# EAGLE design tutuShield (EAGLE 7.1.0)
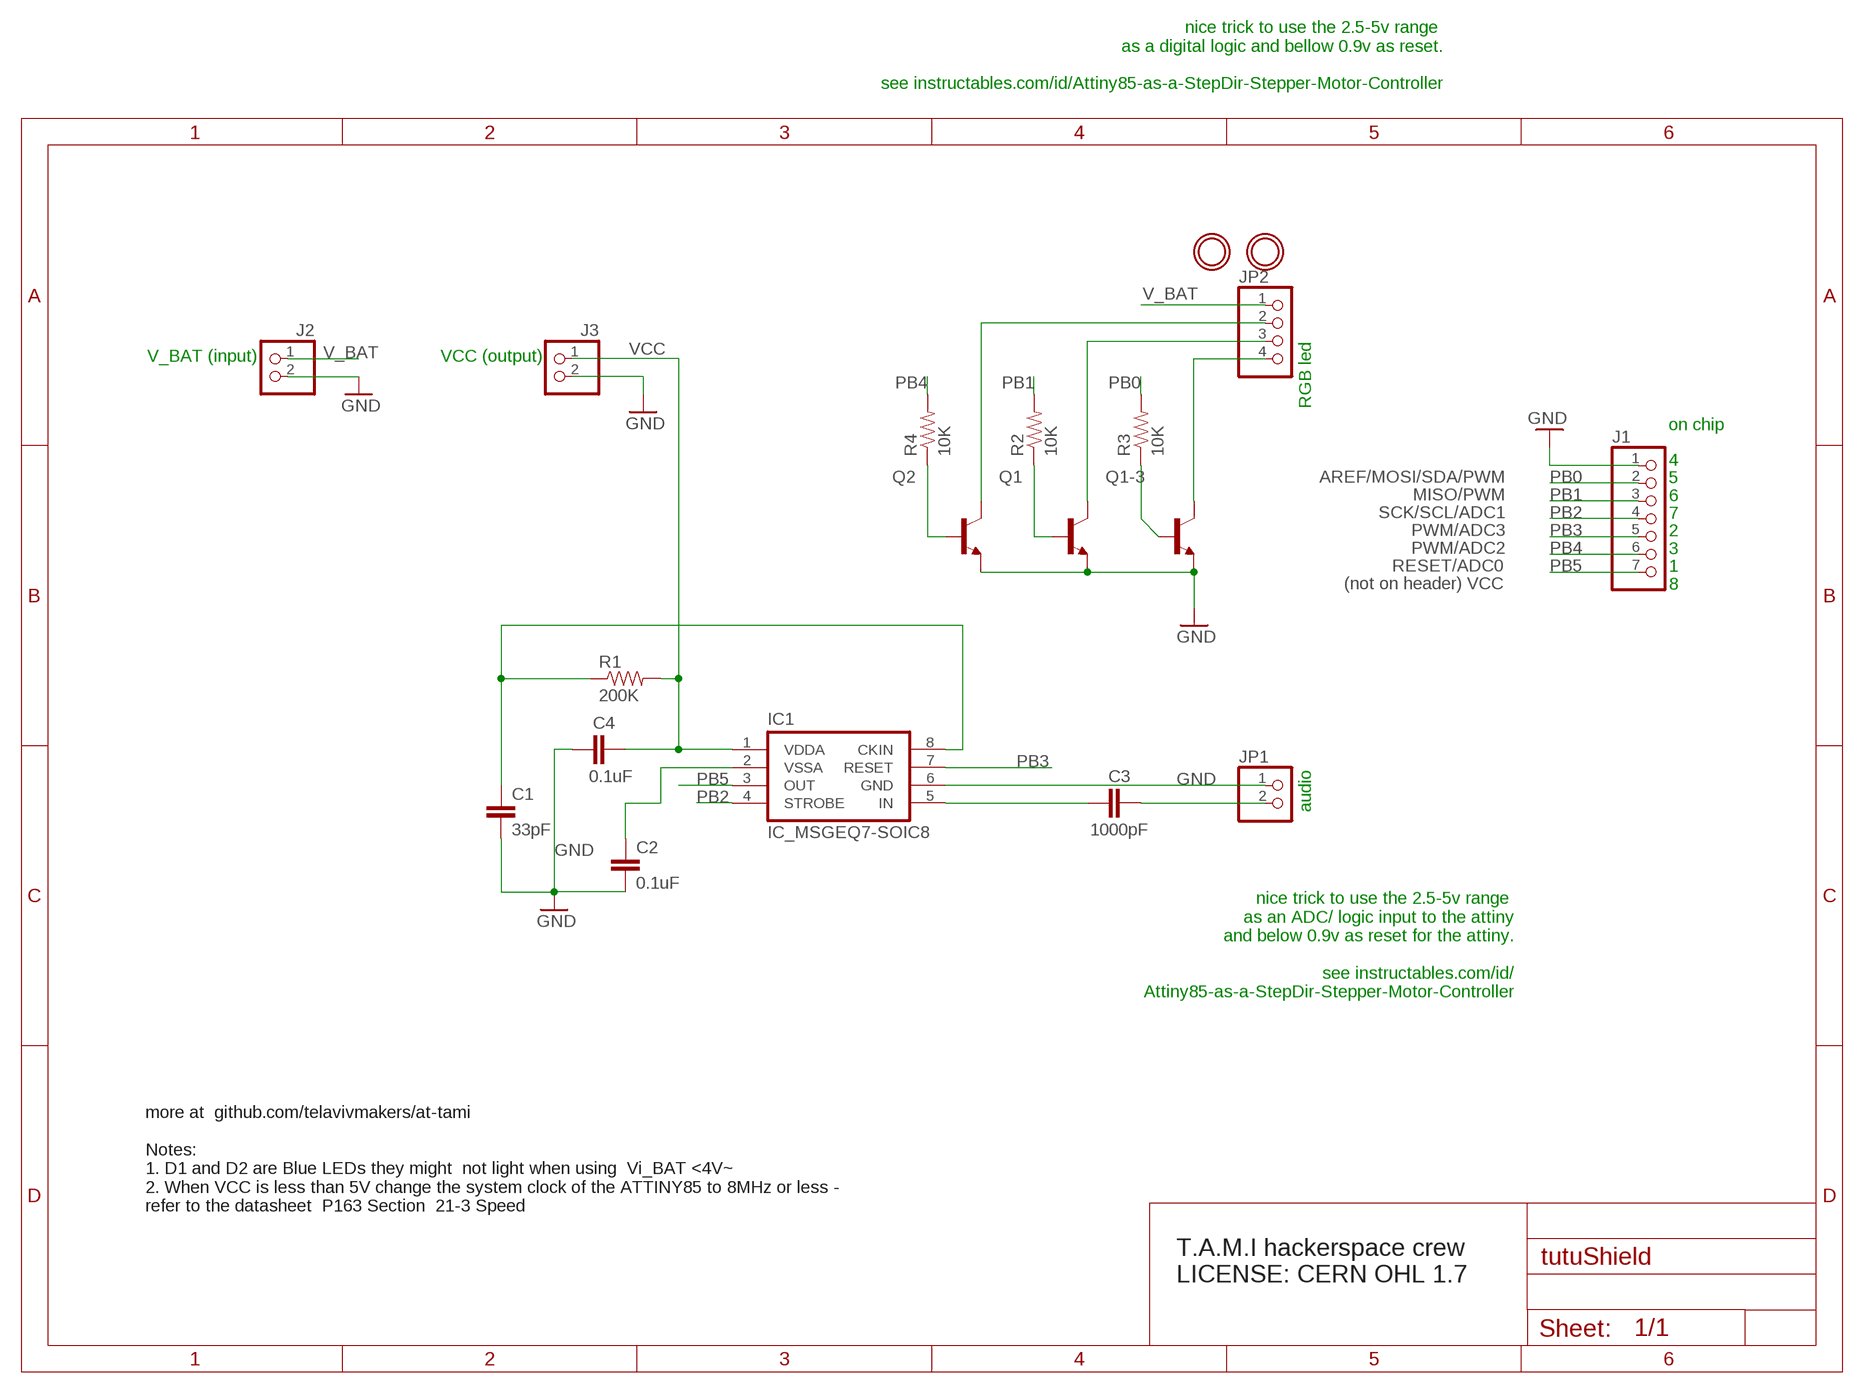
[diagram p0: schematic, sheet 1]

## Parts
C1  33pF  CAP0805  [0805]
C2  0.1uF  CAP0805  [0805]
C3  1000pF  CAP0805  [0805]
C4  0.1uF  CAP0805  [0805]
IC1  IC_MSGEQ7-SOIC8  [SOIC-8]
J1  HEADER-1X7ROUND  [1X07_ROUND]
J2  HEADER-1X2ROUND  [1X02_ROUND]
J3  HEADER-1X2ROUND  [1X02_ROUND]
JP1  HEADER-1X2ROUND  [1X02_ROUND]
JP2  HEADER-1X4ROUND  [1X04_ROUND]
Q1  TRANSISTOR_BJT_NPN-SOT-23-BEC  [SOT-23]
Q1-3  TRANSISTOR_BJT_NPN-SOT-23-BEC  [SOT-23]
Q2  TRANSISTOR_BJT_NPN-SOT-23-BEC  [SOT-23]
R1  200K  RESISTOR0805-RES  [0805]
R2  10K  RESISTOR0805-RES  [0805]
R3  10K  RESISTOR0805-RES  [0805]
R4  10K  RESISTOR0805-RES  [0805]
U$1  MOUNTINGHOLE2.0  [MOUNTINGHOLE_2.0_PLATED]
U$2  MOUNTINGHOLE2.0  [MOUNTINGHOLE_2.0_PLATED]

## Nets
CKIN: C1.1 IC1.8(CKIN) R1.1
GND: C1.2 C2.2 C4.1 IC1.6(GND) J1.1 J2.2 J3.2 JP1.1 Q1-3.2(E) Q1.2(E) Q2.2(E)
IN: C3.1 IC1.5(IN)
N$1: C3.2 JP1.2
N$3: Q1-3.1(B) R3.1
N$4: JP2.2 Q2.3(C)
N$5: C2.1 IC1.2(VSSA)
N$6: Q1.1(B) R2.1
N$7: Q2.1(B) R4.1
N$8: JP2.4 Q1-3.3(C)
N$14: JP2.3 Q1.3(C)
PB0: J1.2 R3.2
PB1: J1.3 R2.2
PB2: IC1.4(STROBE) J1.4
PB3: IC1.7(RESET) J1.5
PB4: J1.6 R4.2
PB5: IC1.3(OUT) J1.7
V_BAT: J2.1 JP2.1
VCC: C4.2 IC1.1(VDDA) J3.1 R1.2

## Notes on the sheet
- nice trick to use the 2.5-5v range 
  as a digital logic and bellow 0.9v as reset.
  
  see instructables.com/id/Attiny85-as-a-StepDir-Stepper-Motor-Controller
- V_BAT (input) | VCC (output)
- RGB led
- AREF/MOSI/SDA/PWM
- MISO/PWM
- SCK/SCL/ADC1
- PWM/ADC3
- PWM/ADC2
- RESET/ADC0
- (not on header) VCC
- on chip
  
  4
  5
  6
  7
  2
  3
  1
  8
- audio
- nice trick to use the 2.5-5v range 
  as an ADC/ logic input to the attiny
  and below 0.9v as reset for the attiny.
  
  see instructables.com/id/
  Attiny85-as-a-StepDir-Stepper-Motor-Controller
- more at  github.com/telavivmakers/at-tami
  
  Notes: 
  1. D1 and D2 are Blue LEDs they might  not light when using  Vi_BAT <4V~  
  2. When VCC is less than 5V change the system clock of the ATTINY85 to 8MHz or less - 
  refer to the datasheet  P163 Section  21-3 Speed
- T.A.M.I hackerspace crew 
  LICENSE: CERN OHL 1.7

## Library data of the parts
C1-C4 = ATtami:CAP: Capacitor Standard 0603 ceramic capacitor, and 0.1" leaded capacitor.
IC1 = ATtami:IC_MSGEQ7: seven band Graphic Equalizer IC
J1 = microbuilder:HEADER-1X7: PIN HEADER
J2 J3 = microbuilder:HEADER-1X2: PIN HEADER
JP1 = ATtami:HEADER-1X2: PIN HEADER
JP2 = ATtami:HEADER-1X4: PIN HEADER
Q1 Q1-3 Q2 = dp_devices:TRANSISTOR_BJT_NPN: Most commonly used is SOT23-BEC
R1-R4 = ATtami:RESISTOR: Resistor Basic schematic elements and footprints for 0603, 1206, and PTH resistors.
U$1 U$2 = microbuilder:MOUNTINGHOLE: Mounting Hole For #2 screws (0.086"/2.18mm width, 0.094"/2.4mm hole) use 2.5mm

## Net classes
0 default: width 0.203 mm
1 vcc: width 0.254 mm

## Board
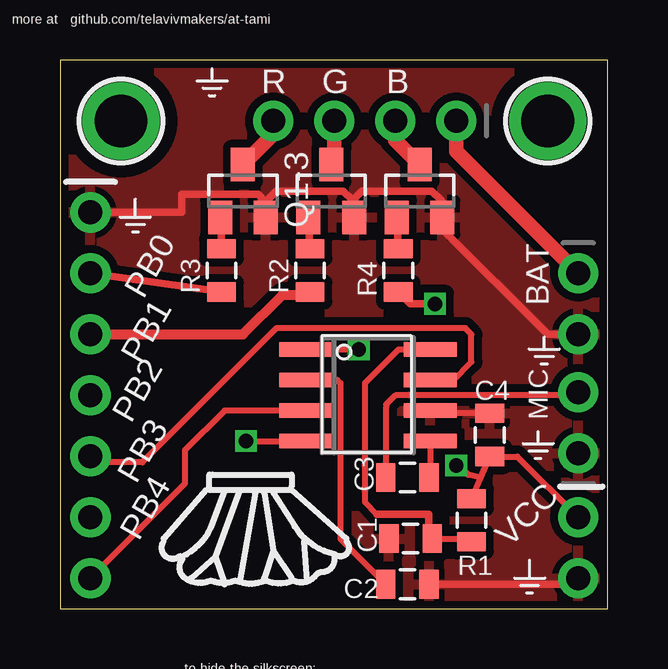
[diagram p1: board, top side]
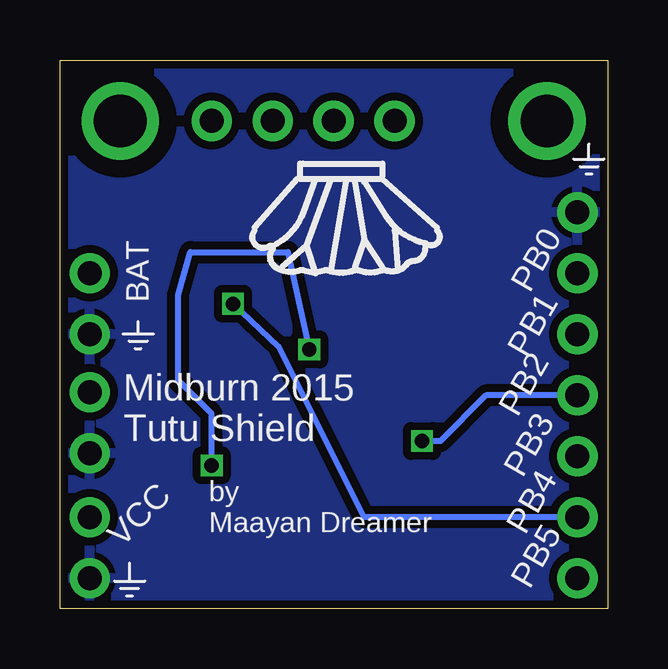
[diagram p2: board, bottom side, seen from below]

Size 22.83 x 22.86 mm. Coordinates in mm from the lower left corner, seen from the top.
Outline: 0,0 22.83,0 22.83,22.86 0,22.86 0,0
Copper layers (1*16): Top 0.035mm / dielectric 1.5mm / Bottom 0.035mm
Design rules "Elecrow_2-layer_eagle_rule": minimum track width 6mil, minimum drill 12mil, track to track 6mil, track to pad 6mil, pad to pad 6mil, via to via 6mil, smd to smd 0mil, copper to edge 10mil, drill to drill 10mil, minimum pad ring 10mil, minimum via ring 6mil, stop-mask expansion 2mil, vias tented up to drill 100mil, thermal gap 10mil

### Footprints (pad centres in the part's own frame; a part is rotated, then mirrored left to right if it is on the bottom)
0805 = smd 0.8 x 1.2: 1 -0.9,0; 2 0.9,0
SOIC-8 = smd 0.6 x 2.2: 1 -1.905,-2.6; 2 -0.635,-2.6; 3 0.635,-2.6; 4 1.905,-2.6; 5 1.905,2.6; 6 0.635,2.6; 7 -0.635,2.6; 8 -1.905,2.6
1X07_ROUND = drill 1 pad 1.676: 1 -7.62,0; 2 -5.08,0; 3 -2.54,0; 4 0,0; 5 2.54,0; 6 5.08,0; 7 7.62,0
1X02_ROUND = drill 1 pad 1.676: 1 -1.27,0; 2 1.27,0
1X04_ROUND = drill 1 pad 1.676: 1 -3.81,0; 2 -1.27,0; 3 1.27,0; 4 3.81,0
SOT-23 = smd 1 x 1.4: 1 -0.95,-1.1; 2 0.95,-1.1; 3 0,1.1
MOUNTINGHOLE_2.0_PLATED = drill 2.2 pad 3: P$1 0,0

### Placement (x,y rotation side)
C1  14.61,2.92 180 top
C2  14.48,1.02 0 top
C3  14.48,5.46 180 top
C4  17.91,7.24 270 top
IC1  12.83,8.89 270 top
J1  1.27,8.89 270 top
J2  21.59,12.7 270 top
J3  21.59,2.54 270 top
JP1  21.59,7.75 90 top
JP2  12.7,20.32 180 top
Q1  11.3,17.4 0 top
Q1-3  7.62,17.4 0 top
Q2  14.99,17.4 0 top
R1  17.14,3.68 90 top
R2  10.41,14.1 270 top
R3  6.73,14.1 270 top
R4  14.1,14.1 270 top
U$1  2.54,20.32 270 top
U$2  20.32,20.32 0 top

### Tracks (layer width: path | path; a pad name or v marks a point on that pad's centre or on a via)
CKIN
  Top 0.254: C1.1 17.14,2.92 R1.1 | IC1.8 14.1,10.79 12.7,9.4 12.7,4.45 13.21,3.94
  Top 0.305: 13.21,3.94 15.37,3.94 15.37,3.05 C1.1
GND
  Top 0.254: C4.1 15.54,8.14 IC1.6
  Top 0.305: C2.2 21.34,1.02 J3.2 | J1.1 5.08,16.51 5.08,17.27 8.26,17.27 8.38,17.14 8.38,16.49 Q1-3.2 8.57,16.95 9.02,17.4 11.81,17.4 12.19,17.02 12.19,16.36 Q1.2 12.25,17.08 12.57,17.4 15.49,17.4 15.88,17.02 15.88,16.36 Q2.2 15.94,15.81 20.32,11.43 J2.2
  pour Bottom (isolate 0.33): 23.37,23.75 -1.52,23.62 -1.21,-1.43 23.37,-1.02
  pour Top (isolate 0.33): -1.02,23.5 -1.02,-0.51 23.62,-0.51 23.3,23.53
IN
  Top 0.254: IC1.5 15.43,5.51 C3.1
N$1
  Top 0.254: JP1.2 21.46,8.89 13.97,8.89 13.59,8.51 13.59,8.38 13.58,8.37 C3.2
N$3
  Top 0.305: Q1-3.1 R3.1
N$4
  Top 0.61: JP2.2 13.97,19.52 Q2.3
N$5
  Top 0.254: IC1.2 11.56,9.53 11.68,9.4 11.68,2.91 C2.1
  Top 0.305: C2.1 13.46,1.02
N$6
  Top 0.305: Q1.1 R2.1
N$7
  Top 0.305: Q2.1 R4.1
N$8
  Top 0.61: JP2.4 8.89,19.77 Q1-3.3
N$14
  Top 0.61: JP2.3 11.43,18.63 Q1.3
PB0
  Top 0.305: R3.2 J1.2
PB1
  Top 0.406: J1.3 7.62,11.43 9.27,13.08 10.3,13.08 R2.2
PB2  (via drill 0.6)
  Top 0.254: v7.75,6.99 IC1.4
  Bottom 0.254: J1.4 5.08,8.89 6.99,6.99 v7.75,6.99
PB3
  Top 0.254: IC1.7 16.38,9.53 17.14,10.29 17.14,11.43 16.89,11.68 9.02,11.68 3.43,6.1 1.52,6.1 J1.5
PB4  (via drill 0.6)
  Top 0.305: v15.62,12.7 14.59,12.7 R4.2
  Bottom 0.254: J1.6 10.16,3.81 13.72,10.92 v15.62,12.7
PB5
  Top 0.254: IC1.3 6.86,8.26 5.21,6.6 5.21,5.21 J1.7
V_BAT
  Top 0.61: JP2.1 16.51,19.05 J2.1
VCC  (via drill 0.6)
  Top 0.254: R1.2 17.53,5.45 | 17.53,5.45 C4.2 19.06,6.34 J3.1 | 17.53,5.45 17.03,5.58 v16.51,5.97 | v12.45,10.79 IC1.1
  Bottom 0.254: v16.51,5.97 16.51,8.13 17.91,9.53 17.91,13.08 17.4,14.86 13.34,14.86 v12.45,10.79

### Text on the board
tPlace: more at github.com/telavivmakers/at-tami | to hide the silkscreen: / disable layers: tNames, bNames, tPlace, bPlace
bPlace: BAT | PB0 | PB1 | PB2 | PB3 | PB4 | VCC | PB5
tNames: R | G | B | BAT | PB0 | PB1 | PB2 | MIC | PB3 | PB4 | VCC
bNames: Midburn 2015 / Tutu Shield | by / Maayan Dreamer
tTest: J2